# EAGLE design BESt-module_v.1.3 (EAGLE 9.6.2)

## Sheet 1 of 2
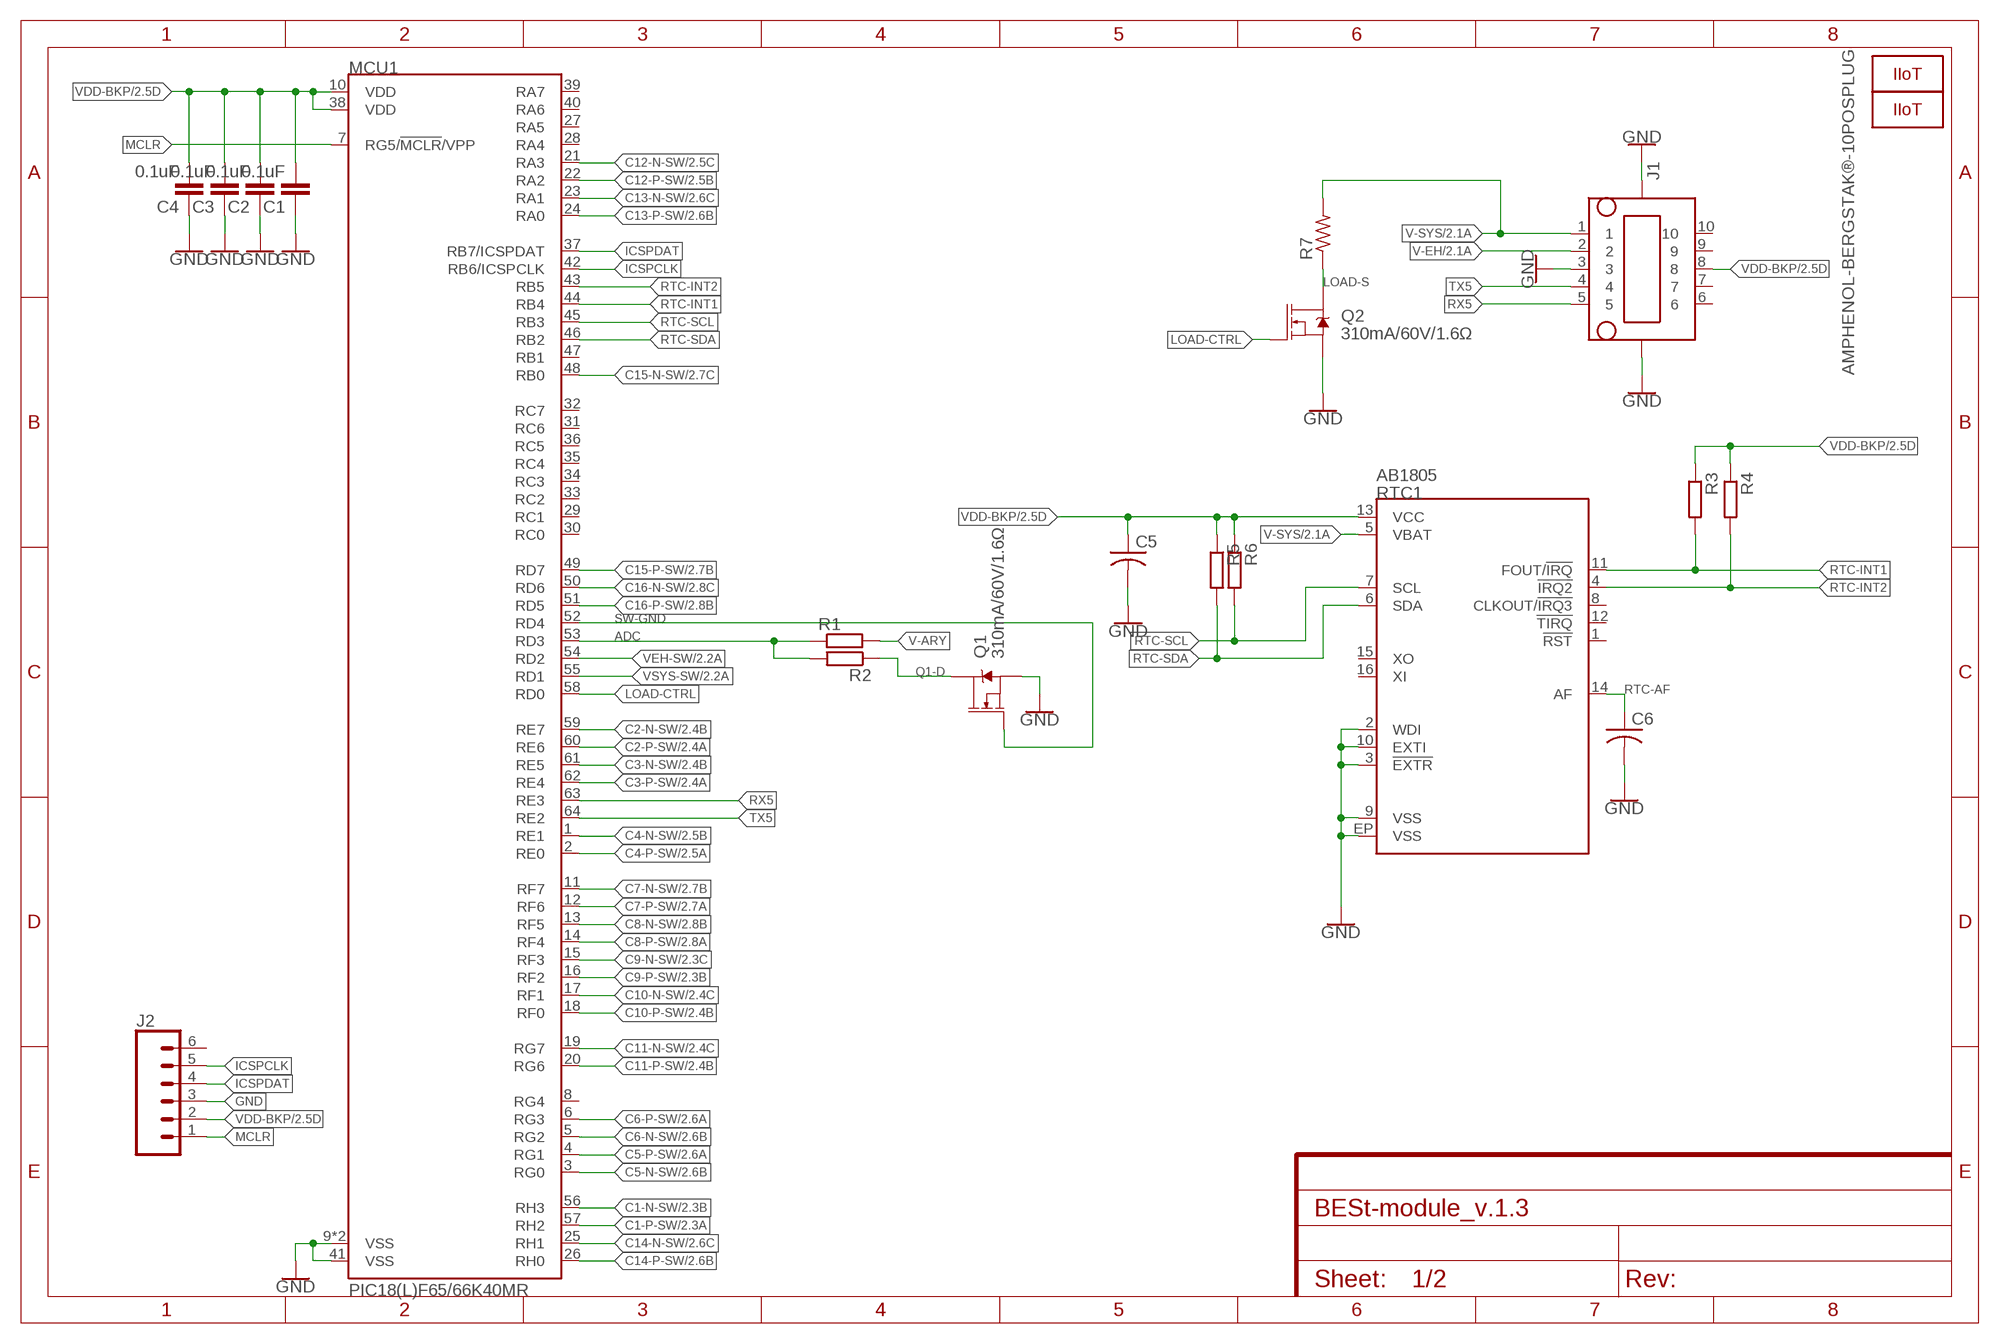
[diagram p0: schematic, sheet 1]

### Parts
C1  0.1uF  0.1UF-0603-25V-5%  [0603]
C2  0.1uF  0.1UF-0603-25V-5%  [0603]
C3  0.1uF  0.1UF-0603-25V-5%  [0603]
C4  0.1uF  0.1UF-0603-25V-5%  [0603]
C5  C-USC0402  [C0402]
C6  C-USC0402  [C0402]
J1  AMPHENOL-BERGSTAK®-10POSPLUG  [10132797-10POS-PLUG]
J2  CONN_06NO_SILK_NO_POP  [1X06_NO_SILK]
LOGO1  IIOT  [IIOT]
LOGO2  IIOT  [IIOT]
MCU1  PIC18(L)F65/66K40MR  [QFN50P900X900X100-65T715N]
Q1  310mA/60V/1.6Ω  MOSFET-NCH-2N7002PW  [SOT323]
Q2  310mA/60V/1.6Ω  MOSFET-NCH-2N7002PW  [SOT323]
R1  R-EU_R0402  [R0402]
R2  R-EU_R0402  [R0402]
R3  R-EU_R0402  [R0402]
R4  R-EU_R0402  [R0402]
R5  R-EU_R0402  [R0402]
R6  R-EU_R0402  [R0402]
R7  R-US_R0805  [R0805]
RTC1  AB1805  [QFN-16-3X3]

### Nets
ADC: MCU1.53(RD3) R1.1 R2.2
C1-N-SW: MCU1.56(RH3) ; also sheet 2
C1-P-SW: MCU1.57(RH2) ; also sheet 2
C2-N-SW: MCU1.59(RE7) ; also sheet 2
C2-P-SW: MCU1.60(RE6) ; also sheet 2
C3-N-SW: MCU1.61(RE5) ; also sheet 2
C3-P-SW: MCU1.62(RE4) ; also sheet 2
C4-N-SW: MCU1.1(RE1) ; also sheet 2
C4-P-SW: MCU1.2(RE0) ; also sheet 2
C5-N-SW: MCU1.3(RG0) ; also sheet 2
C5-P-SW: MCU1.4(RG1) ; also sheet 2
C6-N-SW: MCU1.5(RG2) ; also sheet 2
C6-P-SW: MCU1.6(RG3) ; also sheet 2
C7-N-SW: MCU1.11(RF7) ; also sheet 2
C7-P-SW: MCU1.12(RF6) ; also sheet 2
C8-N-SW: MCU1.13(RF5) ; also sheet 2
C8-P-SW: MCU1.14(RF4) ; also sheet 2
C9-N-SW: MCU1.15(RF3) ; also sheet 2
C9-P-SW: MCU1.16(RF2) ; also sheet 2
C10-N-SW: MCU1.17(RF1) ; also sheet 2
C10-P-SW: MCU1.18(RF0) ; also sheet 2
C11-N-SW: MCU1.19(RG7) ; also sheet 2
C11-P-SW: MCU1.20(RG6) ; also sheet 2
C12-N-SW: MCU1.21(RA3) ; also sheet 2
C12-P-SW: MCU1.22(RA2) ; also sheet 2
C13-N-SW: MCU1.23(RA1) ; also sheet 2
C13-P-SW: MCU1.24(RA0) ; also sheet 2
C14-N-SW: MCU1.25(RH1) ; also sheet 2
C14-P-SW: MCU1.26(RH0) ; also sheet 2
C15-N-SW: MCU1.48(RB0) ; also sheet 2
C15-P-SW: MCU1.49(RD7) ; also sheet 2
C16-N-SW: MCU1.50(RD6) ; also sheet 2
C16-P-SW: MCU1.51(RD5) ; also sheet 2
GND: C1.1 C2.1 C3.1 C4.1 C5.2 C6.2 J1.3 J1.MNT1 J1.MNT2 J2.3 MCU1.9(VSS) MCU1.41(VSS) MCU1.65(VSS) Q1.2(S) Q2.2(S) RTC1.2(WDI) RTC1.3(!EXTR) RTC1.9(VSS) RTC1.10(EXTI) RTC1.EP(VSS) ; also sheet 2
ICSPCLK: J2.5 MCU1.42(RB6/ICSPCLK)
ICSPDAT: J2.4 MCU1.37(RB7/ICSPDAT)
LOAD-CTRL: MCU1.58(RD0) Q2.1(G)
LOAD-S: Q2.3(D) R7.1
MCLR: J2.1 MCU1.7(RG5/!MCLR!/VPP)
Q1-D: Q1.3(D) R2.1
RTC-AF: C6.1 RTC1.14(AF)
RTC-INT1: MCU1.44(RB4) R3.2 RTC1.11(FOUT/!IRQ)
RTC-INT2: MCU1.43(RB5) R4.2 RTC1.4(!IRQ2)
RTC-SCL: MCU1.45(RB3) R6.2 RTC1.7(SCL)
RTC-SDA: MCU1.46(RB2) R5.2 RTC1.6(SDA)
RX5: J1.5 MCU1.63(RE3)
SW-GND: MCU1.52(RD4) Q1.1(G)
TX5: J1.4 MCU1.64(RE2)
V-ARY: R1.2 ; also sheet 2
V-EH: J1.2 ; also sheet 2
V-SYS: J1.1 R7.2 RTC1.5(VBAT) ; also sheet 2
VDD-BKP: C1.2 C2.2 C3.2 C4.2 C5.1 J1.8 J2.2 MCU1.10(VDD) MCU1.38(VDD) R3.1 R4.1 R5.1 R6.1 RTC1.13(VCC) ; also sheet 2
VEH-SW: MCU1.54(RD2) ; also sheet 2
VSYS-SW: MCU1.55(RD1) ; also sheet 2
Unconnected: J1.6 J1.7 J1.9 J1.10 J2.6 MCU1.8(RG4) MCU1.27(RA5) MCU1.28(RA4) MCU1.29(RC1) MCU1.30(RC0) MCU1.31(RC6) MCU1.32(RC7) MCU1.33(RC2) MCU1.34(RC3) MCU1.35(RC4) MCU1.36(RC5) MCU1.39(RA7) MCU1.40(RA6) MCU1.47(RB1) RTC1.1(!RST) RTC1.8(CLKOUT/!IRQ3) RTC1.12(!TIRQ) RTC1.15(XO) RTC1.16(XI)

## Sheet 2 of 2
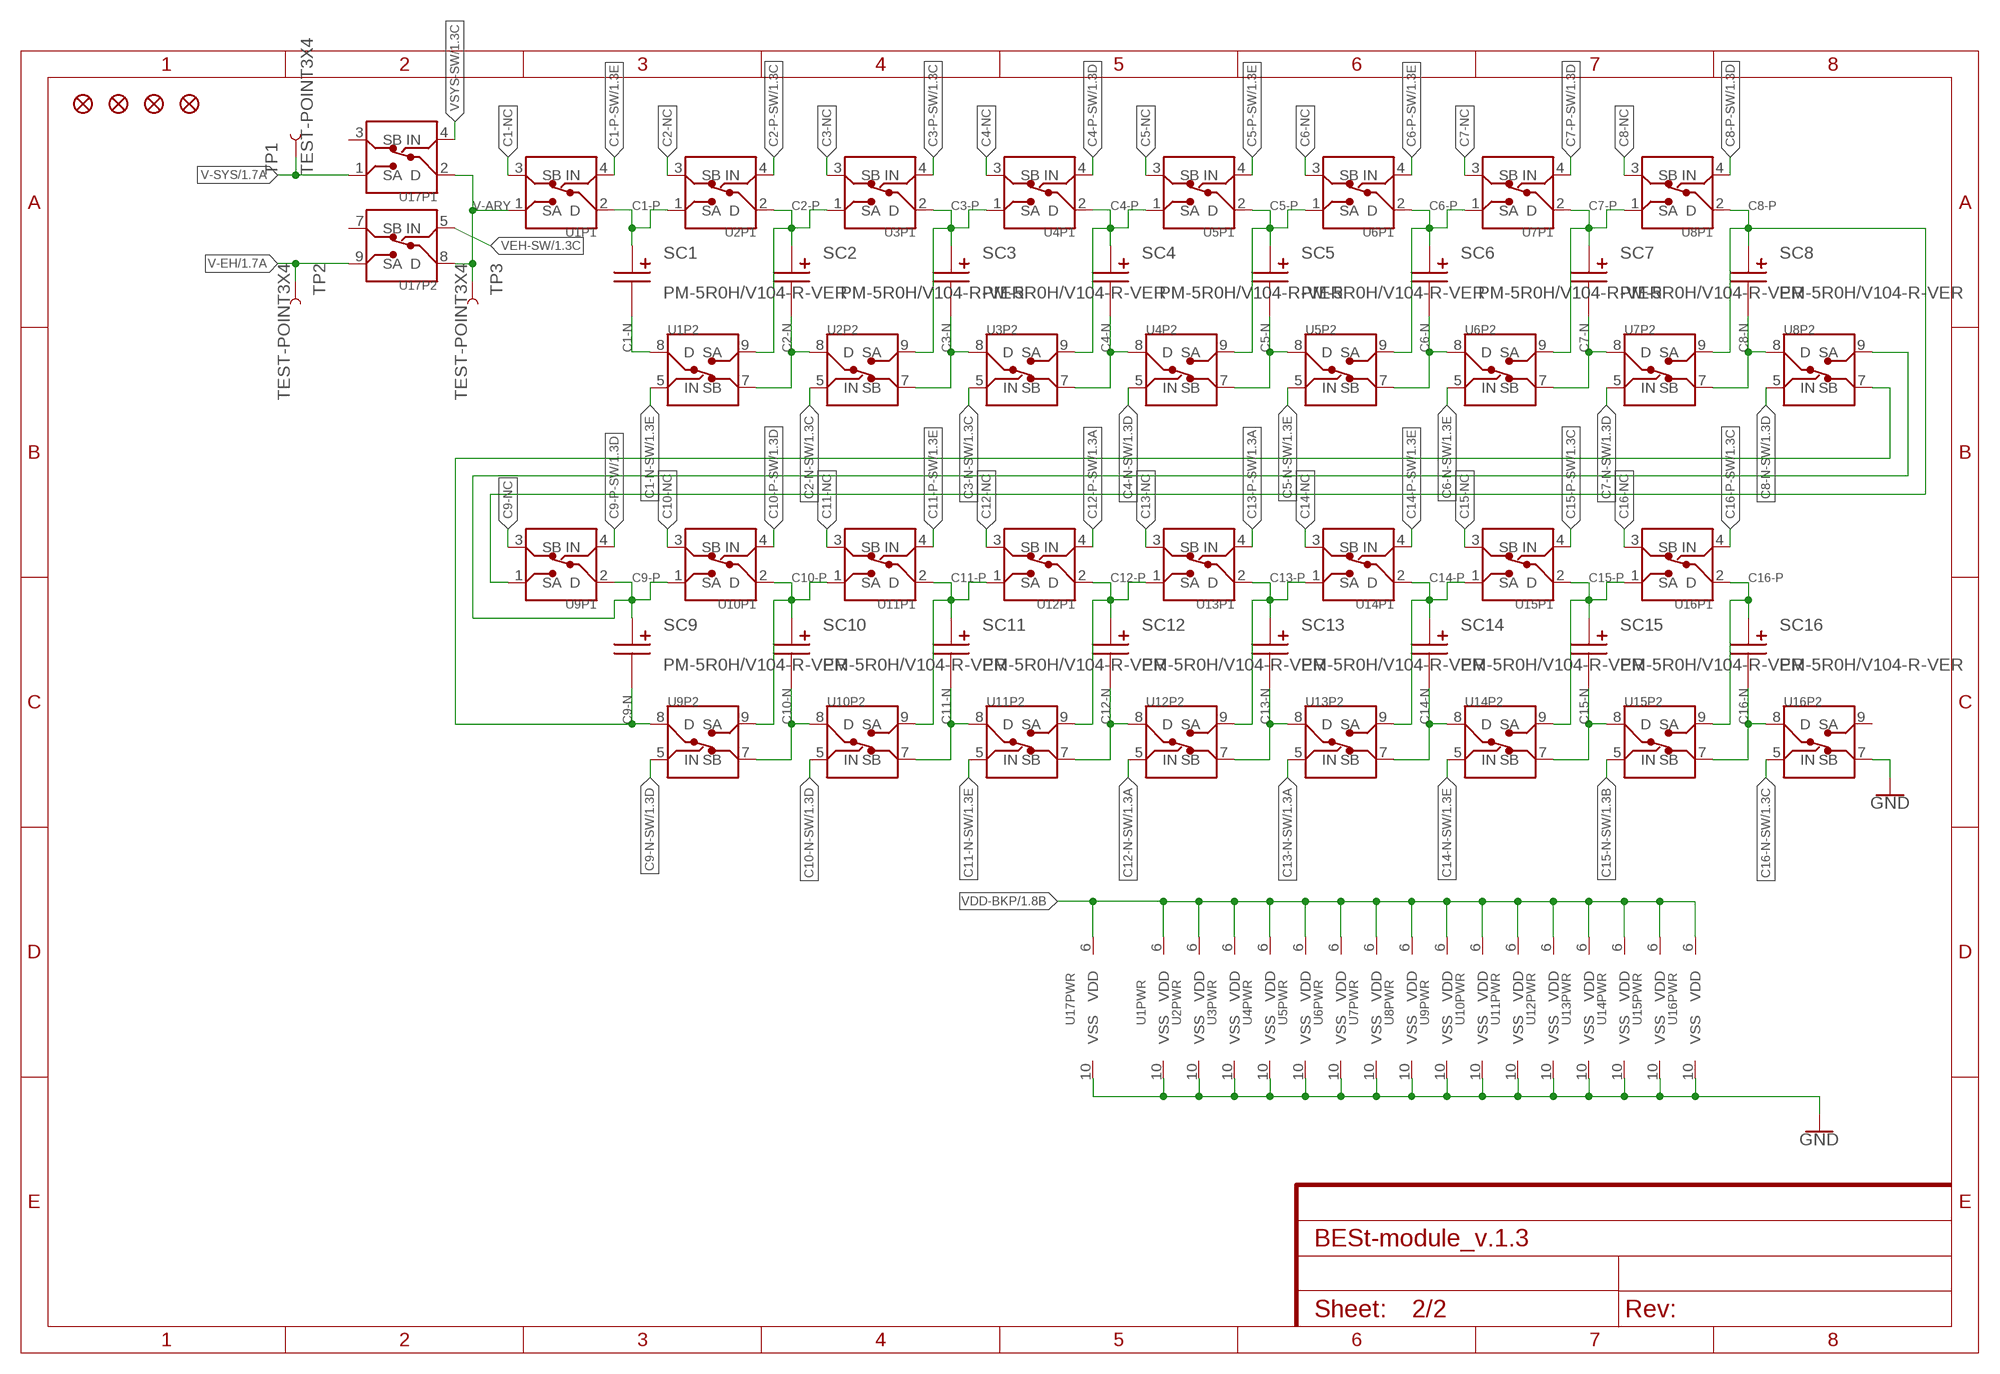
[diagram p1: schematic, sheet 2]

### Parts
FD1  FIDUCIAL1X2  [FIDUCIAL-1X2]
FD2  FIDUCIAL1X2  [FIDUCIAL-1X2]
FD3  FIDUCIAL1X2  [FIDUCIAL-1X2]
FD4  FIDUCIAL1X2  [FIDUCIAL-1X2]
SC1  PM-5R0H/V104-R-VER  [EATON-13X11.3X6-V]
SC2  PM-5R0H/V104-R-VER  [EATON-13X11.3X6-V]
SC3  PM-5R0H/V104-R-VER  [EATON-13X11.3X6-V]
SC4  PM-5R0H/V104-R-VER  [EATON-13X11.3X6-V]
SC5  PM-5R0H/V104-R-VER  [EATON-13X11.3X6-V]
SC6  PM-5R0H/V104-R-VER  [EATON-13X11.3X6-V]
SC7  PM-5R0H/V104-R-VER  [EATON-13X11.3X6-V]
SC8  PM-5R0H/V104-R-VER  [EATON-13X11.3X6-V]
SC9  PM-5R0H/V104-R-VER  [EATON-13X11.3X6-V]
SC10  PM-5R0H/V104-R-VER  [EATON-13X11.3X6-V]
SC11  PM-5R0H/V104-R-VER  [EATON-13X11.3X6-V]
SC12  PM-5R0H/V104-R-VER  [EATON-13X11.3X6-V]
SC13  PM-5R0H/V104-R-VER  [EATON-13X11.3X6-V]
SC14  PM-5R0H/V104-R-VER  [EATON-13X11.3X6-V]
SC15  PM-5R0H/V104-R-VER  [EATON-13X11.3X6-V]
SC16  PM-5R0H/V104-R-VER  [EATON-13X11.3X6-V]
TP1  TEST-POINT3X4  [PAD.03X.04]
TP2  TEST-POINT3X4  [PAD.03X.04]
TP3  TEST-POINT3X4  [PAD.03X.04]
U1  ADG824  [CP-10-10]
U2  ADG824  [CP-10-10]
U3  ADG824  [CP-10-10]
U4  ADG824  [CP-10-10]
U5  ADG824  [CP-10-10]
U6  ADG824  [CP-10-10]
U7  ADG824  [CP-10-10]
U8  ADG824  [CP-10-10]
U9  ADG824  [CP-10-10]
U10  ADG824  [CP-10-10]
U11  ADG824  [CP-10-10]
U12  ADG824  [CP-10-10]
U13  ADG824  [CP-10-10]
U14  ADG824  [CP-10-10]
U15  ADG824  [CP-10-10]
U16  ADG824  [CP-10-10]
U17  ADG824  [CP-10-10]

### Nets
C1-N: SC1.N U1.8(P2:D)
C1-N-SW: U1.5(P2:IN) ; also sheet 1
C1-NC: U1.3(P1:SB)
C1-P: SC1.P U1.2(P1:D) U2.1(P1:SA)
C1-P-SW: U1.4(P1:IN) ; also sheet 1
C2-N: SC2.N U1.7(P2:SB) U2.8(P2:D)
C2-N-SW: U2.5(P2:IN) ; also sheet 1
C2-NC: U2.3(P1:SB)
C2-P: SC2.P U1.9(P2:SA) U2.2(P1:D) U3.1(P1:SA)
C2-P-SW: U2.4(P1:IN) ; also sheet 1
C3-N: SC3.N U2.7(P2:SB) U3.8(P2:D)
C3-N-SW: U3.5(P2:IN) ; also sheet 1
C3-NC: U3.3(P1:SB)
C3-P: SC3.P U2.9(P2:SA) U3.2(P1:D) U4.1(P1:SA)
C3-P-SW: U3.4(P1:IN) ; also sheet 1
C4-N: SC4.N U3.7(P2:SB) U4.8(P2:D)
C4-N-SW: U4.5(P2:IN) ; also sheet 1
C4-NC: U4.3(P1:SB)
C4-P: SC4.P U3.9(P2:SA) U4.2(P1:D) U5.1(P1:SA)
C4-P-SW: U4.4(P1:IN) ; also sheet 1
C5-N: SC5.N U4.7(P2:SB) U5.8(P2:D)
C5-N-SW: U5.5(P2:IN) ; also sheet 1
C5-NC: U5.3(P1:SB)
C5-P: SC5.P U4.9(P2:SA) U5.2(P1:D) U6.1(P1:SA)
C5-P-SW: U5.4(P1:IN) ; also sheet 1
C6-N: SC6.N U5.7(P2:SB) U6.8(P2:D)
C6-N-SW: U6.5(P2:IN) ; also sheet 1
C6-NC: U6.3(P1:SB)
C6-P: SC6.P U5.9(P2:SA) U6.2(P1:D) U7.1(P1:SA)
C6-P-SW: U6.4(P1:IN) ; also sheet 1
C7-N: SC7.N U6.7(P2:SB) U7.8(P2:D)
C7-N-SW: U7.5(P2:IN) ; also sheet 1
C7-NC: U7.3(P1:SB)
C7-P: SC7.P U6.9(P2:SA) U7.2(P1:D) U8.1(P1:SA)
C7-P-SW: U7.4(P1:IN) ; also sheet 1
C8-N: SC8.N U7.7(P2:SB) U8.8(P2:D)
C8-N-SW: U8.5(P2:IN) ; also sheet 1
C8-NC: U8.3(P1:SB)
C8-P: SC8.P U7.9(P2:SA) U8.2(P1:D) U9.1(P1:SA)
C8-P-SW: U8.4(P1:IN) ; also sheet 1
C9-N: SC9.N U8.7(P2:SB) U9.8(P2:D)
C9-N-SW: U9.5(P2:IN) ; also sheet 1
C9-NC: U9.3(P1:SB)
C9-P: SC9.P U8.9(P2:SA) U9.2(P1:D) U10.1(P1:SA)
C9-P-SW: U9.4(P1:IN) ; also sheet 1
C10-N: SC10.N U9.7(P2:SB) U10.8(P2:D)
C10-N-SW: U10.5(P2:IN) ; also sheet 1
C10-NC: U10.3(P1:SB)
C10-P: SC10.P U9.9(P2:SA) U10.2(P1:D) U11.1(P1:SA)
C10-P-SW: U10.4(P1:IN) ; also sheet 1
C11-N: SC11.N U10.7(P2:SB) U11.8(P2:D)
C11-N-SW: U11.5(P2:IN) ; also sheet 1
C11-NC: U11.3(P1:SB)
C11-P: SC11.P U10.9(P2:SA) U11.2(P1:D) U12.1(P1:SA)
C11-P-SW: U11.4(P1:IN) ; also sheet 1
C12-N: SC12.N U11.7(P2:SB) U12.8(P2:D)
C12-N-SW: U12.5(P2:IN) ; also sheet 1
C12-NC: U12.3(P1:SB)
C12-P: SC12.P U11.9(P2:SA) U12.2(P1:D) U13.1(P1:SA)
C12-P-SW: U12.4(P1:IN) ; also sheet 1
C13-N: SC13.N U12.7(P2:SB) U13.8(P2:D)
C13-N-SW: U13.5(P2:IN) ; also sheet 1
C13-NC: U13.3(P1:SB)
C13-P: SC13.P U12.9(P2:SA) U13.2(P1:D) U14.1(P1:SA)
C13-P-SW: U13.4(P1:IN) ; also sheet 1
C14-N: SC14.N U13.7(P2:SB) U14.8(P2:D)
C14-N-SW: U14.5(P2:IN) ; also sheet 1
C14-NC: U14.3(P1:SB)
C14-P: SC14.P U13.9(P2:SA) U14.2(P1:D) U15.1(P1:SA)
C14-P-SW: U14.4(P1:IN) ; also sheet 1
C15-N: SC15.N U14.7(P2:SB) U15.8(P2:D)
C15-N-SW: U15.5(P2:IN) ; also sheet 1
C15-NC: U15.3(P1:SB)
C15-P: SC15.P U14.9(P2:SA) U15.2(P1:D) U16.1(P1:SA)
C15-P-SW: U15.4(P1:IN) ; also sheet 1
C16-N: SC16.N U15.7(P2:SB) U16.8(P2:D)
C16-N-SW: U16.5(P2:IN) ; also sheet 1
C16-NC: U16.3(P1:SB)
C16-P: SC16.P U15.9(P2:SA) U16.2(P1:D)
C16-P-SW: U16.4(P1:IN) ; also sheet 1
GND: U1.10(PWR:VSS) U2.10(PWR:VSS) U3.10(PWR:VSS) U4.10(PWR:VSS) U5.10(PWR:VSS) U6.10(PWR:VSS) U7.10(PWR:VSS) U8.10(PWR:VSS) U9.10(PWR:VSS) U10.10(PWR:VSS) U11.10(PWR:VSS) U12.10(PWR:VSS) U13.10(PWR:VSS) U14.10(PWR:VSS) U15.10(PWR:VSS) U16.7(P2:SB) U16.10(PWR:VSS) U17.10(PWR:VSS) ; also sheet 1
V-ARY: TP3.P$1 U1.1(P1:SA) U17.2(P1:D) U17.8(P2:D) ; also sheet 1
V-EH: TP2.P$1 U17.9(P2:SA) ; also sheet 1
V-SYS: TP1.P$1 U17.1(P1:SA) ; also sheet 1
VDD-BKP: U1.6(PWR:VDD) U2.6(PWR:VDD) U3.6(PWR:VDD) U4.6(PWR:VDD) U5.6(PWR:VDD) U6.6(PWR:VDD) U7.6(PWR:VDD) U8.6(PWR:VDD) U9.6(PWR:VDD) U10.6(PWR:VDD) U11.6(PWR:VDD) U12.6(PWR:VDD) U13.6(PWR:VDD) U14.6(PWR:VDD) U15.6(PWR:VDD) U16.6(PWR:VDD) U17.6(PWR:VDD) ; also sheet 1
VEH-SW: U17.5(P2:IN) ; also sheet 1
VSYS-SW: U17.4(P1:IN) ; also sheet 1
Unconnected: U16.9(P2:SA) U17.3(P1:SB) U17.7(P2:SB)

## Library data of the parts
C1-C4 = SparkFun-Capacitors:0.1UF: 0.1µF ceramic capacitors A capacitor is a passive two-terminal electrical component used to store electrical energy temporarily in an electric field.; PROD_ID: CAP-08604
C5 C6 = adafruit:C-US: CAPACITOR, American symbol
FD1-FD4 = SparkFun-Aesthetics:FIDUCIAL: Fiducial Alignment Points Point-of-reference for pick-and-place machines and other optical instruments.
J1 = Fan_B2B_connector:AMPHENOL-BERGSTAK®-10POS: Amphenol’s BergStak® 0.5mm is a comprehensive and versatile board-to-board solution designed for reliable and high-density applications. The unique design of scoop-proof housing ensures terminals are not damaged during mating.
J2 = SparkFun-Connectors:CONN_06: Multi connection point. Often used as Generic Header-pin footprint for 0.1 inch spaced/style header connections On any of the 0.1 inch spaced packages, you can populate with these: Break Away Headers - Straight <https://www.sparkfun.com/products/116> (PRT-00116) Break Away Male Headers - Right Angle <https://www.sparkfun.com/products/553> (PRT-00553) Female Headers <https://www.sparkfun.com/products/115> (PRT-00115) Break Away Headers - Machine Pin <https://www.sparkfun.com/products/117> (PRT-00117) Break Away Female Headers - Swiss Machine Pin <https://www.sparkfun.com/products/743> (PRT-00743) Arduino Stackable Header - 6 Pin <https://www.sparkfun.com/products/9280> (PRT-09280) For SCREWTERMINALS and SPRING TERMINALS visit here: Screw Terimnals on SparkFun.com <https://www.sparkfun.com/search/results?term=Screw+Terminals> (5mm/3.5mm/2.54mm spacing) This device is also useful as a general connection point to wire up your design to another part of your project. Our various solder wires solder well into these plated through hole pads. Hook-Up Wire - Assortment (Stranded, 22 AWG) <https://www.sparkfun.com/products/11375> (PRT-11375) Hook-Up Wire - Assortment (Solid Core, 22 AWG) <https://www.sparkfun.com/products/11367> (PRT-11367) View the entire wire category on our website here <https://www.sparkfun.com/categories/141>
LOGO1 LOGO2 = Fan_logo:IIOT
MCU1 = Fan_PIC_MCU:PIC18(L)F65/66K40: 64-Pin, Low-Power, High-Performance Microcontrollers with XLP Technology
Q1 Q2 = SparkFun-DiscreteSemi:MOSFET-NCH: N-channel MOSFETs Voltage controlled devices that allow control of high current outputs. SparkFun Products: SparkFun OpenScale <https://www.sparkfun.com/products/13261> SparkFun Digital Sandbox <https://www.sparkfun.com/products/12651> SparkFun Monster Moto Shield <https://www.sparkfun.com/products/10182> SparkFun MOSFET Power Controller <https://www.sparkfun.com/products/11214>; PROD_ID: TRANS-11151
R1-R6 = rcl:R-EU_: RESISTOR, European symbol; SPICEPREFIX: R
R7 = rcl:R-US_: RESISTOR, American symbol; SPICEPREFIX: R
RTC1 = Fan_RTC:AB1805
SC1-SC16 = Fan_SuperCap:PM-5R0H/V104-R: CAP 100MF -20% +80% 5V T/H
TP1-TP3 = SparkFun-Connectors:TEST-POINT: SparkFun Test Points Bare copper test points for troubleshooting or In-Circuit-Testing. These are used by our Production team for verifying production board runs using pogo-pins on test beds. SparkFun Products: SparkFun LSM9DS1 Breakout <https://www.sparkfun.com/products/13284> SparkFun PSOC <https://www.sparkfun.com/products/13714> SparkFun Load Cell Amplifier <https://www.sparkfun.com/products/13879>
U1-U17 = Fan_AnalogMUX:ADG824: 0.5 Ω CMOS 1.65 V to 3.6 V Dual SPDT/2:1 Mux in Mini LFCSP Package

## Board
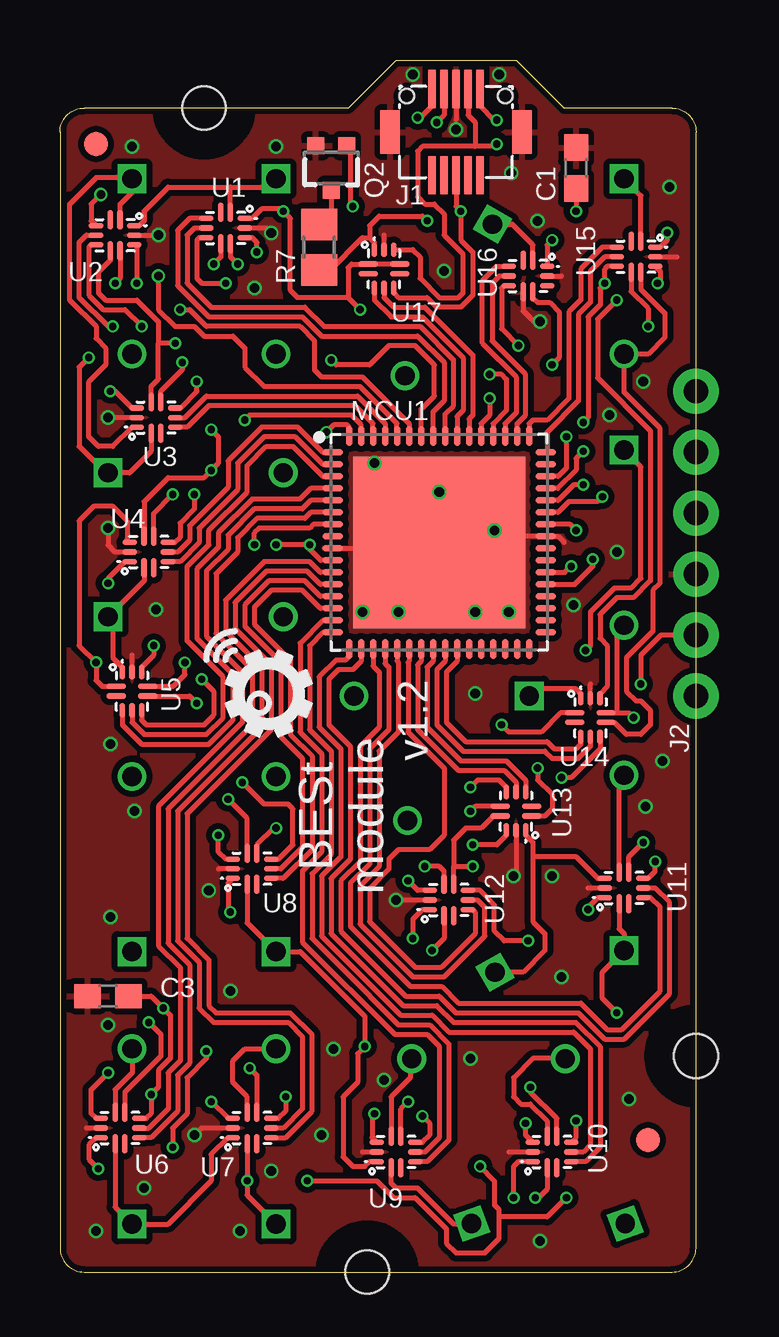
[diagram p2: board, top side]
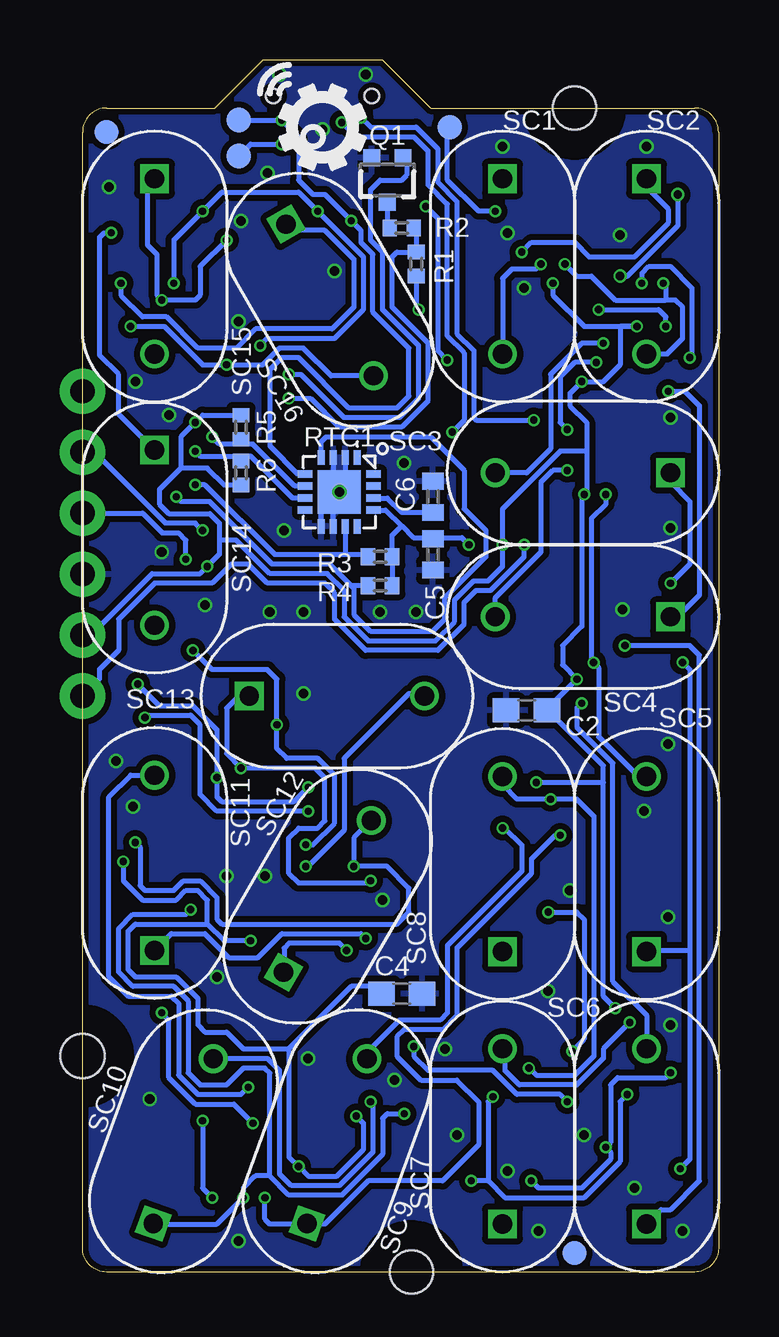
[diagram p3: board, bottom side, seen from below]

Size 26.5 x 50.5 mm. Coordinates in mm from the lower left corner, seen from the top.
Outline: 1,0 25.5,0 arc90 26.5,1 26.5,47.5 arc90 25.5,48.5 21,48.5 19,50.5 14,50.5 12,48.5 1,48.5 arc90 0,47.5 0,1 arc90 1,0
Copper layers (1*16): Top 0.035mm / dielectric 1.5mm / Bottom 0.035mm
Design rules "default *": minimum track width 6mil, minimum drill 0.3mm, track to track 6mil, track to pad 6mil, pad to pad 6mil, via to via 6mil, smd to smd 0mil, copper to edge 6mil, drill to drill 6mil, minimum pad ring 0.2mm, minimum via ring 0.1mm, stop-mask expansion 4mil, vias tented up to drill 0mil, thermal gap 10mil
Holes 1.8 mm at 6,48.5 12.8,0
Holes 1.83 mm at 26.5,9
tRestrict: area 4.2,46.7 to 7.8,48.5; area 24.7,7.2 to 26.5,10.8; area 11,0 to 14.6,1.8
bRestrict: area 11,0 to 14.6,1.8; area 24.7,7.2 to 26.5,10.8; area 4.2,46.7 to 7.8,48.5

### Footprints (pad centres in the part's own frame; a part is rotated, then mirrored left to right if it is on the bottom)
0603 = smd 1.1 x 1: 1 -0.85,0; 2 0.85,0
C0402 = smd 0.7 x 0.9: 1 -0.65,0; 2 0.65,0
FIDUCIAL-1X2 = smd 1 x 1: 1 0,0
10132797-10POS-PLUG = smd 0.3 x 1.6: 1 1,1.8; 2 0.5,1.8; 3 0,1.8; 4 -0.5,1.8; 5 -1,1.8; 6 -1,-1.8; 7 -0.5,-1.8; 8 0,-1.8; 9 0.5,-1.8; 10 1,-1.8 | smd 0.8 x 1.8: MNT1 -2.75,0; MNT2 2.75,0 | hole 0.6: -2.05,1.5; 2.05,1.5
1X06_NO_SILK = drill 1.016 pad 1.88: 1 0,0; 2 2.54,0; 3 5.08,0; 4 7.62,0; 5 10.16,0; 6 12.7,0
QFN50P900X900X100-65T715N = smd 0.837 x 0.264: 1 -4.437,3.75; 2 -4.437,3.25; 3 -4.437,2.75; 4 -4.437,2.25; 5 -4.437,1.75; 6 -4.437,1.25; 7 -4.437,0.75; 8 -4.437,0.25; 9 -4.437,-0.25; 10 -4.437,-0.75; 11 -4.437,-1.25; 12 -4.437,-1.75; 13 -4.437,-2.25; 14 -4.437,-2.75; 15 -4.437,-3.25; 16 -4.437,-3.75; 33 4.437,-3.75; 34 4.437,-3.25; 35 4.437,-2.75; 36 4.437,-2.25; 37 4.437,-1.75; 38 4.437,-1.25; 39 4.437,-0.75; 40 4.437,-0.25; 41 4.437,0.25; 42 4.437,0.75; 43 4.437,1.25; 44 4.437,1.75; 45 4.437,2.25; 46 4.437,2.75; 47 4.437,3.25; 48 4.437,3.75 | smd 0.264 x 0.837: 17 -3.75,-4.437; 18 -3.25,-4.437; 19 -2.75,-4.437; 20 -2.25,-4.437; 21 -1.75,-4.437; 22 -1.25,-4.437; 23 -0.75,-4.437; 24 -0.25,-4.437; 25 0.25,-4.437; 26 0.75,-4.437; 27 1.25,-4.437; 28 1.75,-4.437; 29 2.25,-4.437; 30 2.75,-4.437; 31 3.25,-4.437; 32 3.75,-4.437; 49 3.75,4.437; 50 3.25,4.437; 51 2.75,4.437; 52 2.25,4.437; 53 1.75,4.437; 54 1.25,4.437; 55 0.75,4.437; 56 0.25,4.437; 57 -0.25,4.437; 58 -0.75,4.437; 59 -1.25,4.437; 60 -1.75,4.437; 61 -2.25,4.437; 62 -2.75,4.437; 63 -3.25,4.437; 64 -3.75,4.437 | smd 7.15 x 7.15: 65 0,0
SOT323 = smd 0.7 x 0.7: 1 -0.65,-0.925; 2 0.65,-0.925; 3 0,0.925
R0402 = smd 0.6 x 0.7: 1 -0.5,0; 2 0.5,0
R0805 = smd 1.3 x 1.5: 1 -0.95,0; 2 0.95,0
QFN-16-3X3 = smd 0.6 x 0.3: 1 -1.43,0.75; 2 -1.43,0.25; 3 -1.43,-0.25; 4 -1.43,-0.75; 9 1.43,-0.75; 10 1.43,-0.25; 11 1.43,0.25; 12 1.43,0.75 | smd 0.3 x 0.6: 5 -0.75,-1.43; 6 -0.25,-1.43; 7 0.25,-1.43; 8 0.75,-1.43; 13 0.75,1.43; 14 0.25,1.43; 15 -0.25,1.43; 16 -0.75,1.43 | smd 1.8 x 1.8: EP 0,0
EATON-13X11.3X6-V = drill 0.8: N 0,3.65 | drill 0.8 square: P 0,-3.65
PAD.03X.04 = smd 1.016 x 1.016: P$1 0,0
CP-10-10 = smd 0.22 x 0.6: 1 -0.4,0.8; 4 -0.4,-0.8; 5 0,-0.8; 6 0.4,-0.8; 9 0.4,0.8; 10 0,0.8 | smd 0.8 x 0.22: 2 -0.65,0.2; 3 -0.65,-0.2; 7 0.65,-0.2; 8 0.65,0.2

### Placement (x,y rotation side)
C1  21.5,46 270 top
C2  8,23.4 0 bottom
C3  2,11.5 0 top
C4  13.2,11.6 180 bottom
C5  11.9,29.9 270 bottom
C6  11.9,32.3 90 bottom
FD1  24.5,5.5 0 top
FD2  1.5,47 0 top
FD3  6,0.8 0 bottom
FD4  25.5,47.5 0 bottom
J1  16.5,47.5 0 top
J2  26.5,24 90 top
LOGO1  8.7,24.1 90 top
LOGO2  16.5,47.7 90 bottom
MCU1  15.8,30.4 0 top
Q1  13.8,45.5 180 bottom
Q2  11.3,46 180 top
R1  12.6,42 270 bottom
R2  13.2,43.5 0 bottom
R3  14.1,29.8 180 bottom
R4  14.1,28.6 180 bottom
R5  19.9,35.2 270 bottom
R6  19.9,33.3 90 bottom
R7  10.8,42.7 270 top
RTC1  15.8,32.5 270 bottom
SC1  9,41.9 180 bottom
SC2  3,41.9 180 bottom
SC3  5.65,33.3 90 bottom
SC4  5.65,27.3 90 bottom
SC5  3,17 0 bottom
SC6  3,5.65 0 bottom
SC7  9,5.65 0 bottom
SC8  9,17 0 bottom
SC9  15.9,5.45 340 bottom
SC10  22.3,5.45 340 bottom
SC11  23.5,17.05 0 bottom
SC12  16.3,15.65 330 bottom
SC13  15.9,24 270 bottom
SC14  23.5,30.6 180 bottom
SC15  23.5,41.9 180 bottom
SC16  16.2,40.5 210 bottom
TP1  20,48 0 bottom
TP2  20,46.5 0 bottom
TP3  11.2,47.7 0 bottom
U1  6.9,43.5 270 top
U2  2.3,43.2 270 top
U3  4,35.6 90 top
U4  3.7,30 90 top
U5  3,24.2 0 top
U6  2.5,6 90 top
U7  8,6 90 top
U8  8,16.8 90 top
U9  14,5 90 top
U10  20.5,5 90 top
U11  23.5,16 90 top
U12  16.2,15.5 90 top
U13  19,19.2 180 top
U14  22.1,23.1 0 top
U15  24,42.3 270 top
U16  19.5,41.5 270 top
U17  13.5,41.8 0 top

### Tracks (layer width: path | path; a pad name or v marks a point on that pad's centre or on a via)
ADC  (via drill 0.3)
  Top 0.2: v17.9,36.4 17.9,35.7 17.55,35.35 MCU1.53
  Bottom 0.2: v17.9,36.4 17,36.4 15.8,35.2 13.2,35.2 12.1,36.3 12.1,38.7 13.6,40.2 13.6,42.3 13.4,42.5 R1.1 12.6,43.4 R2.2
C1-N  (via drill 0.3)
  Top 0.2: U1.8 7.1,42.3 v7.4,42
  Bottom 0.2: v7.4,42 7.6,41.8 8.6,41.8 9,41.4 SC1.N
C1-N-SW
  Top 0.2: U1.5 5.6,43.5 5.3,43.2 5.3,41.2 6.3,40.2 10.2,40.2 11,39.4 15,39.4 16.4,38 16.4,36.1 16.05,35.75 MCU1.56
C1-P
  Top 0.2: U1.2 7.1,45.2 | SC1.P 8.65,45.2 7.1,45.2 | 7.1,45.2 4.5,45.2 3.5,44.2 3.5,43.8 3.3,43.6 U2.1
C1-P-SW
  Top 0.2: U1.4 5.4,43.9 4.9,43.4 4.9,41.1 6.2,39.8 10.1,39.8 10.9,39 14.9,39 16,37.9 16,36.3 15.55,35.85 MCU1.57
C2-N  (via drill 0.3)
  Top 0.2: U2.8 2.5,41.4 v2.3,41.2 | U1.7 6.7,42.3 v6.4,42
  Bottom 0.2: SC2.N 2.15,38.25 1.5,38.9 1.5,40.2 1.8,40.5 2.2,40.5 | v6.4,42 5.9,41.5 5.3,41.5 4.3,40.5 2.2,40.5 | v2.3,41.2 2.2,41.1 2.2,40.5
C2-N-SW  (via drill 0.3)
  Top 0.2: v2.2,39.4 2,39.4 0.8,40.6 0.8,42.9 1.1,43.2 U2.5 | MCU1.59 14.55,35.35 12.6,37.3 10.89,37.3 10.6,37.59 10.6,38.8 10,39.4 6.1,39.4 5.4,40.1 v5,40.1
  Bottom 0.2: v2.2,39.4 2.2,39.8 2.5,40.1 v5,40.1
C2-P  (via drill 0.3)
  Top 0.2: U2.2 2.5,44.5 3,45 SC2.P 3,45.6 1.5,45.6 0.4,44.5 0.4,40.5 1.5,39.4 1.5,38.9 1.9,38.5 1.9,37.8 1.2,37.1 1.2,34.8 1.6,34.4 2.2,34.4 3,35.2 U3.1 | v8.2,42.5 8.2,42.9 8,43.1 U1.9
  Bottom 0.2: SC2.P 3,45.2 2.1,44.3 2.1,43.7 3.5,42.3 5.4,42.3 6,42.9 7.8,42.9 v8.2,42.5
C2-P-SW  (via drill 0.35)
  Top 0.2: U2.4 1.3,43.8 1.3,44.5 v1.7,44.9 | v4.1,41.5 4.1,40.1 4.8,39.4 5.6,39.4 | MCU1.60 14.03,34.85 14.03,35.36 12.5,36.9 8.5,36.9 7.7,37.7 7.7,38.5 7.2,39 6,39 5.6,39.4 | 5.6,39.4
  Bottom 0.2: v1.7,44.9 1.7,43.6 3.8,41.5 v4.1,41.5
C3-N  (via drill 0.3)
  Top 0.2: v4.8,38.7 4.1,38.7 | 4.1,38.7 4.1,39.6 3.2,40.5 1.9,40.5 1.6,40.8 1.6,41.65 2.1,42.15 U2.7 | U3.8 3.8,36.9 4.1,37.2 4.1,38.7
  Bottom 0.2: v4.8,38.7 5.7,38.7 7,37.4 7,34.3 8,33.3 SC3.N
C3-N-SW
  Top 0.2: U3.5 5.2,35.6 6.1,36.5 12.4,36.5 13.55,35.35 MCU1.61
C3-P  (via drill 0.3)
  Top 0.2: v1.2,38.1 0.8,37.7 0.8,34.4 1.9,33.3 SC3.P 2.9,33.3 3.8,34.2 U3.2 | U2.9 3.2,42.8 v3.2,41.2 | U4.1 2.7,29.6 2,28.9 v2,28.7
  Bottom 0.2: SC3.P 2,32.9 1.2,32.1 1.2,29.5 v2,28.7 | v1.2,38.1 1.1,38.2 1.1,41 2,41.9 2.9,41.9 3.2,41.6 v3.2,41.2
C3-P-SW
  Top 0.2: MCU1.62 13.03,34.85 13.03,35.36 12.3,36.1 6.2,36.1 5.3,35.2 U3.4
C4-N  (via drill 0.3)
  Top 0.2: U3.7 4.2,36.7 5.1,37.6 v5.1,37.9 | v6.3,35.1 6.6,34.8 6.6,33.7 v6.3,33.4 6,33.1 4.5,33.1 3.5,32.1 U4.8
  Bottom 0.2: v6.3,33.4 6.9,33.4 7.4,32.9 7.4,30 9.3,28.1 SC4.N | v6.3,35.1 6.6,35.4 6.6,37.3 6,37.9 v5.1,37.9
C4-N-SW
  Top 0.2: MCU1.1 10.95,34.15 9.9,35.2 8.4,35.2 7,33.8 7,32.7 5.4,31.1 5.4,30.5 4.9,30 U4.5
C4-P  (via drill 0.3)
  Top 0.2: U3.9 3,36 2.3,36.7 v2.1,36.7 | U4.2 3.5,28.8 SC4.P 2.2,27.1 2.2,25.6 2.6,25.2 U5.1
  Bottom 0.2: SC4.P 1.7,27.3 0.8,28.2 0.8,36.1 1.4,36.7 v2.1,36.7
C4-P-SW
  Top 0.2: MCU1.2 10.95,33.65 9.8,34.8 8.5,34.8 7.4,33.7 7.4,32.6 5.8,31 5.8,30.4 5,29.6 U4.4
C5-N  (via drill 0.3)
  Top 0.2: U4.7 3.9,31.6 v4.7,32.4 | v5.21,25.39 5.21,24.89 4.71,24.4 U5.8
  Bottom 0.2: v4.7,32.4 4.7,32 5.3,31.4 5.3,25.48 v5.21,25.39 5,25.18 5,22.3 3.35,20.65 SC5.N
C5-N-SW
  Top 0.2: MCU1.3 10.95,33.15 9.7,34.4 8.6,34.4 7.8,33.6 7.8,32.5 6.2,30.9 6.2,30.3 5.3,29.4 5.3,26.3 6.8,24.8 6.8,23.1 6.1,22.4 3.5,22.4 3,22.9 U5.5
C5-P  (via drill 0.3)
  Top 0.2: U4.9 2.8,30.5 2.8,31.3 2.2,31.9 1.4,31.9 0.8,31.3 0.8,26.1 v1.5,25.4 1.5,24.65 1.75,24.4 U5.2 | U6.1 1.5,5.6 1.2,5.3 1.2,4.7 v1.6,4.3
  Bottom 0.2: v1.6,4.3 1.2,4.7 1.2,13.4 | v1.5,25.4 1.2,25.1 1.2,13.4 | SC5.P 2.95,13.4 1.2,13.4
C5-P-SW
  Top 0.2: MCU1.4 10.45,32.65 10,32.2 8,32.2 6.6,30.8 6.6,30.2 5.7,29.3 5.7,26.4 7.2,24.9 7.2,23 6.2,22 3.4,22 2.6,22.8 U5.4
C6-N  (via drill 0.3)
  Top 0.2: SC6.N 3,8.3 2.3,7.6 U6.8 | U5.7 5.4,24 v5.7,23.7
  Bottom 0.2: SC6.N 3,10.7 4.4,12.1 4.4,21.2 5.9,22.7 5.9,23.5 v5.7,23.7
C6-N-SW
  Top 0.2: MCU1.5 10.45,32.15 10.1,31.8 8.1,31.8 7,30.7 7,30.1 6.1,29.2 6.1,26.5 7.6,25 7.6,22.9 4.1,19.4 4.1,13.6 5,12.7 5,8.8 4.5,8.3 4.5,6.8 3.7,6 U6.5
C6-P  (via drill 0.3)
  Top 0.2: U6.2 2.3,2.7 SC6.P 4.5,2 6.3,3.8 6.3,4.9 7,5.6 U7.1 | U5.9 3.4,25.2 3.9,25.7 v3.9,26.1
  Bottom 0.2: SC6.P 2.4,2.6 2,2.6 0.8,3.8 0.8,25.7 1.2,26.1 v3.9,26.1
C6-P-SW
  Top 0.2: MCU1.6 10.45,31.65 10.2,31.4 8.2,31.4 7.4,30.6 7.4,30 6.5,29.1 6.5,26.6 8,25.1 8,22.8 4.5,19.3 4.5,13.7 5.4,12.8 5.4,8.7 4.9,8.2 4.9,6.7 3.8,5.6 U6.4
C7-N  (via drill 0.3)
  Top 0.2: v3.7,10.4 4.2,9.9 4.2,9 2.7,7.5 U6.7 | U7.8 7.8,7.3 7.2,7.9 7.2,8.8 7.7,9.3 SC7.N
  Bottom 0.2: v3.7,10.4 4.8,9.3 4.8,8.9 5.9,7.8 8.3,7.8 8.9,8.4 8.9,9.2 SC7.N
C7-N-SW
  Top 0.2: MCU1.11 10.85,29.15 10.4,29.6 8.5,29.6 6.9,28 6.9,26.7 8.4,25.2 8.4,22.7 4.9,19.2 4.9,13.8 5.8,12.9 5.8,11 6.4,10.4 9.5,10.4 10.1,9.8 10.1,6.8 9.3,6 U7.5
C7-P  (via drill 0.3)
  Top 0.2: v6.1,9.2 6.1,8.9 5.3,8.1 5.3,6.6 4.7,6 v4.7,5.2 | U6.9 1.5,6.4 1.3,6.6 1.3,7.6 v2,8.3 | U7.2 v7.8,3.8 7.8,3.2 SC7.P | U8.1 7,16.2 7,15.1 v7.1,15
  Bottom 0.2: v7.1,15 5.9,15 5.6,14.7 5.6,9.7 v6.1,9.2 | v2,8.3 2.2,8.1 4.2,8.1 4.5,7.8 4.5,5.39 v4.7,5.2 4.5,5 4.5,4.7 5.7,3.5 7.5,3.5 v7.8,3.8
C7-P-SW
  Top 0.2: MCU1.12 10.85,28.65 10.3,29.2 8.6,29.2 7.3,27.9 7.3,26.8 8.8,25.3 8.8,22.6 5.3,19.1 5.3,13.9 6.2,13 6.2,11.1 6.5,10.8 9.6,10.8 10.5,9.9 10.5,6.7 9.4,5.6 U7.4
C8-N  (via drill 0.3)
  Top 0.2: v7.9,8.5 8.2,8.2 U7.7 | U8.8 7.8,18.9 v7,19.7
  Bottom 0.2: SC8.N 9,20.3 8.4,19.7 v7,19.7 5.9,19.7 5.2,19 5.2,9 6,8.2 7.6,8.2 v7.9,8.5
C8-N-SW
  Top 0.2: MCU1.13 10.85,28.15 10.2,28.8 8.7,28.8 7.7,27.8 7.7,26.9 9.2,25.4 9.2,22.3 10.1,21.4 10.1,17.7 9.2,16.8 U8.5
C8-P  (via drill 0.3)
  Top 0.2: U7.9 7,6.4 v6.3,7.1 | U8.2 7.8,14.55 SC8.P 10,13.35 12.7,10.65 v12.7,9.4 12.4,9.1 12.4,7.9 11.8,7.3 11.8,4.8 12.2,4.4 12.7,4.4 12.9,4.6 U9.1
  Bottom 0.2: v6.3,7.1 6.6,7.4 8.4,7.4 9.4,8.4 12.1,8.4 12.7,9 v12.7,9.4
C8-P-SW
  Top 0.2: MCU1.14 10.85,27.65 10.1,28.4 8.8,28.4 8.1,27.7 8.1,27 9.6,25.5 9.6,22.4 10.5,21.5 10.5,17.6 9.3,16.4 U8.4
C9-N  (via drill 0.3)
  Top 0.2: U8.7 8.2,17.8 8.9,18.5 v9,18.5 | SC9.N 14.6,8.83 14.6,8.1 13.8,7.3 U9.8
  Bottom 0.2: v9,18.5 8.9,18.5 8.2,17.8 8.2,16.7 11.3,13.6 11.3,10.8 11.6,10.5 13.3,10.5 14.6,9.2 14.6,8.93 SC9.N
C9-N-SW
  Top 0.2: MCU1.15 10.95,27.15 10,26.2 10,22.5 10.9,21.6 10.9,17.5 10.1,16.7 10.1,13.75 13.95,9.9 15.3,9.9 15.8,9.4 15.8,5.6 15.2,5 U9.5
C9-P  (via drill 0.3)
  Top 0.2: SC9.P 17.13,2 16.4,2 14.9,3.5 14,3.5 13.8,3.7 U9.2 | U8.9 6.9,17.2 6.6,17.5 v6.6,18.2 | U10.1 19.1,4.6 18.9,4.4 v18.9,3.1
  Bottom 0.2: v18.9,3.1 18.9,2.2 18.7,2 17.17,2 SC9.P 17.13,2 16.4,2 14.6,3.8 11.5,3.8 10,5.3 10,7.1 10.9,8 12.4,8 13.4,9 13.4,9.8 13.1,10.1 11.5,10.1 10.9,10.7 10.9,13.5 7.8,16.6 7.8,17.2 6.8,18.2 v6.6,18.2
C9-P-SW
  Top 0.2: MCU1.16 10.95,26.65 10.4,26.1 10.4,22.6 11.3,21.7 11.3,17.4 10.5,16.6 10.5,13.9 12.9,11.5 13.4,11 14.1,10.3 15.4,10.3 16.2,9.5 16.2,5.5 15.3,4.6 U9.4
C10-N  (via drill 0.3)
  Top 0.2: SC10.N 21.03,8.9 19.7,8.9 18.9,8.1 18.9,7.3 19.2,7 19.6,7 20.3,6.3 U10.8 | U9.7 14.2,6.8 v14.5,7.1
  Bottom 0.2: SC10.N 21.03,8.9 18.8,8.9 18.3,8.4 18.3,4.1 17.8,3.6 15.8,3.6 14.4,5 14.4,7 v14.5,7.1
C10-N-SW
  Top 0.2: MCU1.17 12.05,25.66 11.89,25.5 11.5,25.5 10.8,24.8 10.8,22.7 11.7,21.8 11.7,17.3 10.9,16.5 10.9,14 14.2,10.7 15.5,10.7 16.2,10 21.4,10 22.1,9.3 22.1,5.3 21.8,5 U10.5
C10-P  (via drill 0.3)
  Top 0.2: U9.9 13,5.6 13,6.5 v13.1,6.6 | U10.2 20.3,3.45 19.95,3.1 v19.8,3.1 | U11.1 22.4,15.6 22,15.2 v22,15.1
  Bottom 0.2: v13.1,6.6 13.8,6.6 14,6.4 14,4.9 15.7,3.2 17.9,3.2 18.7,4 | 18.7,4 18.7,8.3 18.9,8.5 19.8,8.5 20.5,7.8 21.6,7.8 22.1,8.3 22.1,11.3 22.7,11.9 24.4,11.9 25,12.5 25,14.3 24.4,14.9 22.2,14.9 v22,15.1 | SC10.P 23.53,2 20.9,2 v19.8,3.1 19.8,3.5 19.3,4 18.7,4
C10-P-SW
  Top 0.2: MCU1.18 12.55,25.45 12.2,25.1 11.6,25.1 11.2,24.7 11.2,22.8 12.1,21.9 12.1,17.2 11.3,16.4 11.3,14.1 14.3,11.1 15.7,11.1 16.4,10.4 21.5,10.4 22.5,9.4 22.5,5.2 21.9,4.6 U10.4
C11-N  (via drill 0.3)
  Top 0.2: U10.7 20.7,6.4 19.6,7.5 v19.6,7.7 | U11.8 23.3,20.5 SC11.N
  Bottom 0.2: SC11.N 24.5,20.7 25.4,19.8 25.4,12.3 24.6,11.5 22.8,11.5 22.5,11.2 22.5,8.2 21.7,7.4 19.9,7.4 v19.6,7.7
C11-N-SW
  Top 0.2: MCU1.19 13.05,25.25 13.3,25 13.3,22.7 12.5,21.9 12.5,17.1 11.7,16.3 11.7,14.2 14.4,11.5 15.8,11.5 16.5,10.8 21.6,10.8 22.7,9.7 23.5,9.7 25.4,11.6 25.4,15.4 24.8,16 U11.5
C11-P  (via drill 0.3)
  Top 0.2: U10.9 19.4,5.7 v19.4,6.2 | v23.2,10.8 22.6,11.4 22.6,12.5 SC11.P 23.5,14.1 23.3,14.3 U11.2 | U12.1 15.1,15.1 14.7,14.7 v14.7,13.9
  Bottom 0.2: v14.7,13.9 14.9,14.1 18.2,14.1 19.2,13.1 20.4,13.1 21.4,14.1 22.8,14.1 SC11.P | v19.4,6.2 20.2,7 21.8,7 22.9,8.1 22.9,10.5 v23.2,10.8
C11-P-SW
  Top 0.2: MCU1.20 13.55,25.35 13.7,25.2 13.7,22.6 12.9,21.8 12.9,17 12.1,16.2 12.1,14.4 14.6,11.9 15.9,11.9 16.6,11.2 21.7,11.2 22.8,10.1 23.4,10.1 25,11.7 25,15.2 24.6,15.6 U11.4
C12-N  (via drill 0.3)
  Top 0.2: U11.7 23.7,17.3 v24.3,17.9 | U12.8 16,16.7 15.8,16.9 v15.2,16.9
  Bottom 0.2: v24.3,17.9 24.1,17.7 24.1,16.1 23.9,15.9 22.7,15.9 22.3,16.3 21.6,16.3 20.9,15.6 20.9,14.7 20.7,14.5 13.4,14.5 12.9,15 12.9,16 13.8,16.9 v15.2,16.9 15.2,18.09 SC12.N
C12-N-SW
  Top 0.2: MCU1.21 14.05,25.45 14.1,25.4 14.1,22.5 13.3,21.7 13.3,16.9 12.5,16.1 12.5,14.5 14.7,12.3 16,12.3 17.7,14 17.7,15.2 17.4,15.5 U12.5
C12-P  (via drill 0.3)
  Top 0.2: 19.7,17.3 21.5,17.3 22.4,16.4 U11.9 | 19.7,17.3 19.7,14.6 20.2,14.1 20.2,13.4 19.3,12.5 18.14,12.5 SC12.P | U12.2 16,13.9 v15.5,13.4 | U13.1 19.4,18.2 19.7,17.9 19.7,17.3
  Bottom 0.2: v15.5,13.4 15.8,13.7 17.9,13.7 18.1,13.5 18.1,12.51 SC12.P
C12-P-SW
  Top 0.2: U12.4 17.2,15.1 17.3,15 17.3,14.1 15.9,12.7 14.8,12.7 12.9,14.6 12.9,16 13.7,16.8 13.7,17.2 14.1,17.6 15.4,17.6 16,18.2 16,21 14.5,22.5 14.5,25.4 14.55,25.45 MCU1.22
C13-N  (via drill 0.3)
  Top 0.2: U12.7 16.4,16.9 | 16.4,16.9 v17.2,16.9 | U13.8 18.05,19 17.55,18.5 16.9,18.5 16.4,18 16.4,16.9
  Bottom 0.2: v17.2,16.9 17.1,16.9 15.6,18.4 15.6,21.4 12.9,24.1 12.35,24.1 SC13.N
C13-N-SW
  Top 0.2: MCU1.23 15.05,25.45 14.9,25.3 14.9,22.6 16.6,20.9 18.5,20.9 19,20.4 U13.5
C13-P  (via drill 0.3)
  Top 0.2: U12.9 14.9,15.9 v14.5,16.3 | U13.2 20.2,19 20.5,19.3 20.5,19.9 19.9,20.5 v19.9,21 | U14.1 21.7,24.1 21.5,24.3 19.85,24.3 SC13.P
  Bottom 0.2: v14.5,16.3 14.6,16.2 17.5,16.2 17.9,16.6 17.9,18.1 17.5,18.5 16.7,18.5 16.4,18.8 16.4,20.6 16.8,21 v19.9,21 20.5,21.6 20.5,23.5 20,24 SC13.P
C13-P-SW
  Top 0.2: MCU1.24 15.55,25.45 15.3,25.2 15.3,22.7 16.7,21.3 18.6,21.3 19.4,20.5 U13.4
C14-N  (via drill 0.3)
  Top 0.2: v17.1,19.2 17.3,19.4 U13.7 | U14.8 23.2,23.3 | 23.2,23.3 23.7,23.3 v23.9,23.1 | SC14.N 23.2,26.65 23.2,23.3
  Bottom 0.2: v17.1,19.2 20.9,19.2 21.6,19.9 21.6,22.8 22,23.2 23.8,23.2 v23.9,23.1
C14-N-SW
  Top 0.2: U14.5 22.1,21.9 21.6,21.4 20.5,21.4 20.2,21.7 16.8,21.7 15.7,22.8 15.7,25.1 16.05,25.45 MCU1.25
C14-P  (via drill 0.3)
  Top 0.2: v21.9,25.9 22.1,26.1 22.1,27.5 23.1,28.5 23.8,28.5 24.2,28.9 24.2,33.55 SC14.P | U13.9 18.6,18.2 18.2,17.8 v17.2,17.8 | U14.2 20.85,23.3 20.05,22.5 18.7,22.5 v18.4,22.8 | v25.3,43.3 25.3,43 25,42.7 U15.1
  Bottom 0.2: SC14.P 25,35.75 25,37.4 25.8,38.2 25.8,43.1 25.6,43.3 v25.3,43.3 | v17.2,17.8 16.9,17.8 16,18.7 16,20.7 16.7,21.4 18,21.4 18.4,21.8 v18.4,22.8 18.4,24.7 18.8,25.1 21.1,25.1 v21.9,25.9
C14-P-SW
  Top 0.2: MCU1.26 16.55,25.45 16.1,25 16.1,22.9 16.9,22.1 20.3,22.1 20.6,21.8 21.5,21.8 21.7,22 U14.4
C15-N
  Top 0.2: U15.8 24.2,40.95 25.2,39.95 25.2,38.95 24.5,38.25 SC15.N 23.5,36.65 25,35.15 25,28.7 24.7,28.4 24.7,26.7 23.6,25.6 23.6,24.2 24,23.8 24.2,23.8 24.6,23.4 24.6,22.8 24.2,22.4 23.6,22.4 23.1,22.9 U14.7
C15-N-SW
  Top 0.2: U15.5 22.7,42.3 22.1,41.7 22.1,40.4 21.6,39.9 21.6,36.3 20.3,35 20.3,34.21 MCU1.48
C15-P  (via drill 0.3)
  Top 0.2: SC15.P 24.2,44.85 U15.2 | v23.2,40.5 22.4,39.7 22.4,37.25 24.6,35.05 24.6,28.8 23.9,28.1 23.2,28.1 22.5,27.4 22.5,26.4 22.8,26.1 22.8,24.4 22.5,24.1 U14.9 | U16.1 20.3,42.8 v20.5,43
  Bottom 0.2: SC15.P 23.8,45.25 23.8,42.8 23.4,42.4 23.4,40.7 v23.2,40.5 21.8,40.5 21.6,40.7 21.6,41.9 v20.5,43
C15-P-SW
  Top 0.2: U15.4 22.6,42.7 21.7,41.8 21.7,40.5 21.2,40 21.2,36.4 20.3,35.5 19.7,35.5 19.55,35.35 MCU1.49
C16-N  (via drill 0.3)
  Top 0.2: U15.7 23.8,40.85 24.5,40.15 v24.5,39.4 | v20.5,37.8 20.8,38.1 20.8,40 20.4,40.4 19.9,40.4 19.7,40.6 U16.8
  Bottom 0.2: SC16.N 16.14,37.34 17.3,38.5 18.3,38.5 19,37.8 v20.5,37.8 21.5,37.8 23.1,39.4 v24.5,39.4
C16-N-SW
  Top 0.2: U16.5 18.3,41.5 18,41.2 18,38.8 19.4,37.4 19.4,35.7 19.05,35.35 MCU1.50
C16-P  (via drill 0.3)
  Top 0.2: U15.9 25,41.7 25,41.3 v24.9,41.2 | U16.2 19.7,42.8 18.84,43.66 SC16.P
  Bottom 0.2: SC16.P 17.76,43.4 16.4,43.4 15.2,42.2 15.2,40.2 16.1,39.3 19.3,39.3 20.1,38.5 21.7,38.5 23,39.8 24,39.8 24.9,40.7 v24.9,41.2
C16-P-SW
  Top 0.2: U16.4 18.2,41.9 17.6,41.3 17.6,38.7 19,37.3 19,35.8 18.55,35.35 MCU1.51
GND  (via drill 0.4, 0.4 pad 0.55)
  Top 0.2: MCU1.9 12.55,30.15 | 19.05,30.65 MCU1.41 20.75,30.65 21,30.4 | J1.3 16.5,48 | v8.8,43.3 8.6,43.5 U1.10 | U2.10 v4.1,43.2 | U3.10 v2,35.6 | U4.10 2.3,30 2,30.3 v2,31 | U6.10 1.1,6 | U7.10 6.31,6 5.9,6 v5.6,5.7 | U8.10 6.6,16.8 | U9.10 12.6,5 | U10.10 18.7,5 | U11.10 22,16 | U12.10 v14,15.5 | U13.10 19,16.6 v18.9,16.5 | U14.10 22.1,24.5 | U16.7 19.3,40.05 19.75,39.6 v20,39.6 | U16.10 20.9,41.5 | U15.10 25.7,42.3 | U17.10 13.5,43.2 | U5.10 3,25.7
  Bottom 0.2: RTC1.3 16.05,32.75 RTC1.EP | RTC1.2 15.55,32.75 RTC1.EP | RTC1.10 16.05,32.25 RTC1.EP | RTC1.9 16.55,31.75 RTC1.EP
  other vias: 2.1,22 2,10.3 11.4,9.3 7.1,11.7 10.9,5.7 13.5,8 23.7,7.2 17.1,8.9 2.1,14.8 20,1.3 1.5,1.7 24.3,37.1 6.2,15.9 25.1,21.3 21.4,27.8 17.3,24.1 23.2,30 3,46.9 19.9,43.8 22.9,35.7 18.8,45.8 18.3,49.9 16.5,47.6 14.7,49.9 4,27.6 7.5,1.7 12.6,27.5 9,46.9 25.4,45.2 15.8,32.5 17.3,27.5 13.1,33.7 18.1,30.9 18.7,27.5 14.1,27.5 8.1,41 3.1,19.2 3.5,3.5 8.8,4.2 20.5,16.5 24.4,19.4 16,41.7 20.9,12.3
  pour Top (isolate 0.254, rank 6): 0,0 26.5,0 26.5,50.5 0,50.5
  pour Bottom (isolate 0.254): 0,0 26.5,0 26.5,50.5 0,50.5
ICSPCLK  (via drill 0.3)
  Top 0.2: v21.5,30.9 21.25,31.15 MCU1.42
  Bottom 0.2: v21.5,30.9 21.8,31.2 23.04,31.2 26,34.16 J2.5
ICSPDAT  (via drill 0.3)
  Top 0.2: v22.2,29.7 22.2,29.4 21.45,28.65 MCU1.37
  Bottom 0.2: J2.4 24,31.62 23.18,30.8 22.5,30.8 22.2,30.5 v22.2,29.7
LOAD-CTRL  (via drill 0.3)
  Top 0.2: MCU1.58 15.05,35.95 15.6,36.5 15.6,37.8 14.8,38.6 13.7,38.6 12.9,37.8 11.5,37.8 v11.3,38 | Q2.1 12.1,46.77 12.1,44.5 v12.2,44.4
  Bottom 0.2: v12.2,44.4 11.7,43.9 11.7,38.4 v11.3,38
LOAD-S
  Top 0.2: Q2.3 11.3,44.15 R7.1
MCLR  (via drill 0.3)
  Top 0.2: MCU1.7 10.55,31.15 10.4,31 8.3,31 8.1,30.8 v8.1,30.3
  Bottom 0.2: J2.1 25.8,24.7 25.8,25.1 25,25.9 25,27.2 23.5,28.7 21.1,28.7 20.3,29.5 19.6,29.5 18.8,28.7 16.4,28.7 16,28.3 16,27.2 14.7,25.9 11.7,25.9 10.6,27 10.6,27.9 10.1,28.4 9.5,28.4 8.1,29.8 v8.1,30.3
Q1-D
  Bottom 0.2: Q1.3 13.8,43.58 13.72,43.5 R2.1
RTC-AF
  Bottom 0.2: RTC1.14 13.8,32.25 13.2,31.65 C6.1
RTC-INT1  (via drill 0.3)
  Top 0.2: MCU1.44 20.75,32.15 21.4,32.8 v21.8,32.8
  Bottom 0.2: v21.8,32.8 21.4,32.8 18.5,29.9 15.55,29.9 | RTC1.11 15.55,29.9 | 15.55,29.9 14.7,29.9 R3.2
RTC-INT2  (via drill 0.3)
  Top 0.2: v22.6,32.3 22.4,32.1 21.2,32.1 20.75,31.65 MCU1.43
  Bottom 0.2: RTC1.4 16.55,34.6 16.35,34.8 12,34.8 10.6,33.4 10.6,31.8 9.7,30.9 9.7,29.8 11.4,28.1 11.4,27.2 11.9,26.7 14.51,26.7 15.2,27.39 15.2,28.5 15.3,28.6 | v22.6,32.3 22.4,32.1 21.2,32.1 18.6,29.5 16.2,29.5 15.3,28.6 | R4.2 15.3,28.6
RTC-SCL  (via drill 0.3)
  Top 0.2: v21.8,34.2 21.5,33.9 21.5,33.4 20.75,32.65 MCU1.45
  Bottom 0.2: RTC1.7 17.75,32.25 19.5,34 19.9,34 | v21.8,34.2 21.6,34 19.9,34 | R6.2 19.9,34
RTC-SDA  (via drill 0.3)
  Top 0.2: v21.1,34.8 21.1,33.5 20.75,33.15 MCU1.46
  Bottom 0.2: RTC1.6 17.65,32.75 19.4,34.5 19.9,34.5 | 19.9,34.5 20.8,34.5 v21.1,34.8 | R5.2 19.9,34.5
RX5  (via drill 0.3)
  Top 0.2: MCU1.63 12.55,35.3 12.15,35.7 7.9,35.7 v7.7,35.5 | J1.5 15.5,48.6 15,48.1 v14.9,48.1
  Bottom 0.2: v7.7,35.5 10.1,35.5 10.2,35.6 10.2,38.4 10.9,39.1 10.9,44.6 11.7,45.4 11.7,46.8 12.6,47.7 14.5,47.7 v14.9,48.1
SW-GND  (via drill 0.3)
  Top 0.2: MCU1.52 18.05,35.35 18.6,35.9 18.6,37.2 18.4,37.4 v17.9,37.4
  Bottom 0.2: v17.9,37.4 17.4,37.4 15.6,35.6 13.3,35.6 12.5,36.4 12.5,38.6 14,40.1 14,42.5 14.5,43 14.5,45.1 14.1,45.5 13.2,45.5 13,45.7 13,46.27 Q1.1
TX5  (via drill 0.3)
  Top 0.2: MCU1.64 12.05,35.2 11.95,35.3 11.4,35.3 v11.1,35 | J1.4 16,48.2 v15.7,47.9
  Bottom 0.2: v11.1,35 10.6,35.5 10.6,38.3 11.3,39 11.3,44.5 12.1,45.3 12.1,46.7 12.7,47.3 15.1,47.3 v15.7,47.9
V-ARY  (via drill 0.3)
  Top 0.2: U17.8 U17.2 12.15,42 12,41.85 12,40.6 | 12,40.6 v12.5,40.1 | U1.1 8,43.9 8.4,44.3 9.2,44.3 v9.3,44.2 9.6,43.9 9.6,40.9 9.9,40.6 12,40.6
  Bottom 0.2: R1.2 12.6,40.2 v12.5,40.1 | v9.3,44.2 10,44.2 11.3,45.5 11.3,47.6 TP3.P$1
V-EH  (via drill 0.3)
  Top 0.2: J1.2 17,48.2 17.3,47.9 17.3,46.9 | v18.2,47 18.1,46.9 17.3,46.9 | 17.3,46.9 15.1,46.9 14.9,46.7 14.9,44.8 15.2,44.5 15.6,44.5 16,44.1 16,43.2 16.8,42.4 16.8,40.8 16.6,40.6 15.8,40.6 15,41.4 15,42.3 14.7,42.6 U17.9
  Bottom 0.2: TP2.P$1 19.5,47 v18.2,47
V-SYS  (via drill 0.3)
  Top 0.2: J1.1 17.5,48.6 18.1,48 v18.2,48 | R7.2 11.25,41.75 12.6,43.1 12.9,43.1 | v15.3,43.8 15.1,44 13.3,44 12.9,43.6 12.9,43.1 | U17.1 13.1,42.9 12.9,43.1
  Bottom 0.2: RTC1.5 17.53,33.25 18.7,34.42 18.7,37.6 18.2,38.1 17.5,38.1 15.4,36 13.4,36 12.9,36.5 12.9,38.5 14.4,40 14.4,42.4 14.9,42.9 14.9,43.4 v15.3,43.8 16.4,44.9 16.9,44.9 17.5,45.5 17.5,47.3 v18.2,48 TP1.P$1
VDD-BKP  (via drill 0.3)
  Top 0.2: v21.3,29.4 v21.29,29.41 21.04,29.15 MCU1.38 | MCU1.10 10.86,29.65 10.4,30.11 v10.4,30.3 v9,30.3 | 18.3,2.3 18.3,1.4 17.7,0.8 16.5,0.8 16.1,1.2 16.1,1.8 14.8,3.1 13.9,3.1 13.2,3.8 v10.3,3.8 | 18.3,2.3 18.3,2.6 18.1,2.8 18.1,3.8 v17.5,4.4 | J1.8 16.5,44.4 v16.7,44.2 16.7,43 17.2,42.5 17.2,40.7 16.7,40.2 15.7,40.2 15.3,40.6 14.1,40.6 13.9,40.8 U17.6 | U2.6 1.3,42.8 1.2,42.7 1.2,40.7 1.8,40.1 2.7,40.1 v3.4,39.4 | U1.6 5.8,43.1 5.7,43 5.7,41.4 5.9,41.2 v6.9,41.2 | U3.6 5,36 5.7,36.7 v5.7,37.1 | v5.6,32.4 5.6,31.8 5,31.2 5,30.6 4.8,30.4 U4.6 | v5.9,24.7 6.4,24.2 6.4,23.2 6,22.8 3.6,22.8 3.4,23 U5.6 | U6.6 3.6,6.4 3.8,6.6 v3.8,7.4 4.1,7.7 4.1,8.4 4.6,8.9 4.6,10.7 v4.3,11 3.8,11.5 C3.2 | v9.4,7.3 9.4,6.7 9.1,6.4 U7.6 | U8.6 9.1,17.2 9.7,17.8 9.7,19.3 9.5,19.5 8.5,19.5 v7.6,20.4 | U9.6 15.1,5.4 15.4,5.7 15.4,6.2 v15.1,6.5 | U10.6 21.5,5.6 v21.5,6.3 | v21.1,3.1 20.3,2.3 18.3,2.3 | U11.6 24.5,16.4 24.8,16.7 v24.8,17.1 | v19.5,13.8 18.5,13.8 18.1,14.2 18.1,15.3 17.5,15.9 U12.6 | U13.6 18.6,20.2 18.3,20.5 17.4,20.5 v17.1,20.2 | U14.6 22.5,21.8 21.3,20.6 v20.9,20.6 | J2.2 25.04,26.54 24.2,25.7 v24.2,24.5 | U15.6 22.8,41.9 22.7,41.8 v22.7,41.2 22.5,41 22.5,40.3 22,39.8 22,35.6 v21.8,35.4 | U16.6 18.5,41.1 18.4,41 18.4,39.3 v19.1,38.6 | C1.2 v21.5,44.2
  Bottom 0.2: J2.2 26.16,26.54 23.6,29.1 21.6,29.1 v21.3,29.4 20.8,29.9 20.8,30.5 | v9.4,7.3 9.6,7.1 9.6,3.8 | v4.3,11 4.8,11.5 4.8,20.4 | 17.9,9.3 17.9,4.8 v17.5,4.4 17.1,4 15.9,4 14.8,5.1 14.8,6.2 v15.1,6.5 | 9.6,3.8 v10.3,3.8 | v6.9,41.2 6.9,40.7 5.6,39.4 v3.4,39.4 4.1,39.4 4.1,37.8 4.8,37.1 v5.7,37.1 6.2,36.6 6.2,36.1 5.5,35.4 5.5,34.2 | C2.2 7.15,23.45 | 7.15,23.45 v5.9,24.7 6.5,25.3 6.5,26.1 5.7,26.9 5.7,32.3 v5.6,32.4 5.5,32.5 5.5,34.2 | C4.2 14.35,11.9 15.3,11.9 17.9,9.3 | v10.4,30.3 10.7,30.6 11.85,30.6 C5.1 11.95,30.6 12.72,30.6 13.21,31.09 | RTC1.13 13.87,31.75 13.21,31.09 | 22.4,33.5 22.4,34.8 v21.8,35.4 21.5,35.7 R5.1 | 22.4,33.5 23.3,32.6 23.3,32 22.9,31.6 21.2,31.6 20.8,31.2 20.8,30.5 | 22.4,33.5 21.3,33.5 20.6,32.8 R6.1 | R4.1 R3.1 13.6,30.7 13.21,31.09 | 5.5,34.2 6.6,34.2 9,31.8 v9,30.3 9,29.4 9.6,28.8 10.2,28.8 11,28 11,27.1 11.8,26.3 14.61,26.3 15.6,27.3 15.6,28.4 16.3,29.1 18.7,29.1 20.1,30.5 20.8,30.5 | v3.8,7.4 4.1,7.1 4.1,4.6 5.6,3.1 8.9,3.1 9.6,3.8 | v21.5,6.3 21.5,3.5 v21.1,3.1 | 17.9,9.3 19.8,9.3 20.5,10 21.4,10 21.7,10.3 21.7,11.4 22.6,12.3 24.3,12.3 24.6,12.6 24.6,14.2 24.3,14.5 21.3,14.5 | v24.8,17.1 24.8,16.3 24,15.5 22.6,15.5 22.2,15.9 21.7,15.9 21.3,15.5 21.3,14.5 | v19.5,13.8 20.6,13.8 21.3,14.5 | v17.1,20.2 17.7,19.6 20.7,19.6 20.9,19.8 v20.9,20.6 20.9,22.6 21.9,23.6 23.3,23.6 v24.2,24.5 | v19.1,38.6 18.8,38.9 16,38.9 14.8,40.1 14.8,42.3 v16.7,44.2 17.5,45 20.7,45 v21.5,44.2 22.7,43 v22.7,41.2 | 4.8,20.4 4.8,21.1 7.15,23.45 | v7.6,20.4 4.8,20.4
VEH-SW
  Top 0.2: U17.5 13.5,40.6 13.9,40.2 15.2,40.2 17.2,38.2 17.2,35.7 17.05,35.55 MCU1.54
VSYS-SW
  Top 0.2: U17.4 13.1,40.5 13.8,39.8 15.1,39.8 16.8,38.1 16.8,35.9 16.55,35.65 MCU1.55

### Text on the board
tNames: v1.2 | BESt / module